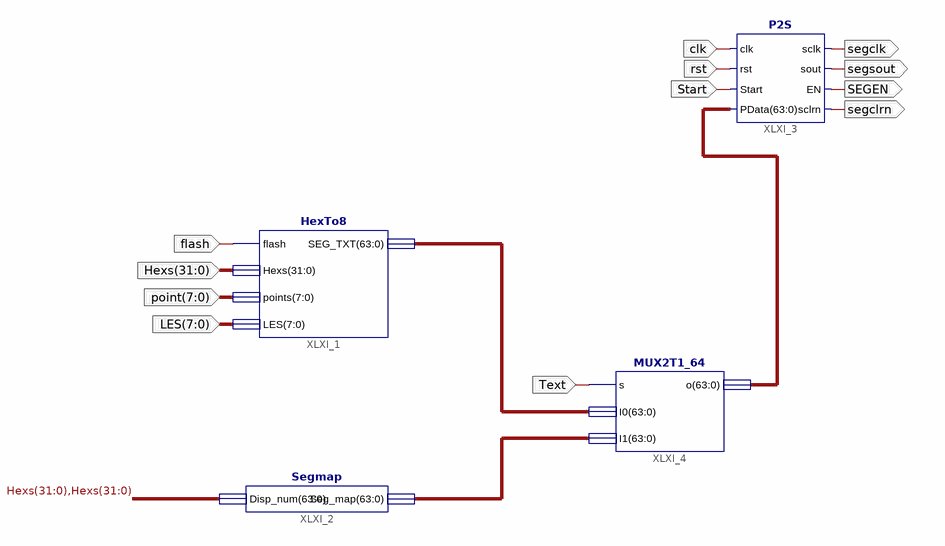
[diagram p0: schematic sheet 1]
// Xilinx ISE schematic Display.sch (kintex7) as structural Verilog: 4 symbols, 12 ports
module Display (
  input  flash,
  input  [31:0] Hexs,
  input  [7:0] point,
  input  [7:0] LES,
  input  rst,
  input  Start,
  input  clk,
  input  Text,
  output segclrn,
  output segsout,
  output SEGEN,
  output segclk
);

  wire [63:0] XLXN_13, XLXN_14, XLXN_15;

  HexTo8 XLXI_1 (.flash(flash), .Hexs(Hexs), .points(point), .LES(LES), .SEG_TXT(XLXN_13));
  Segmap XLXI_2 (.Disp_num({Hexs, Hexs}), .Seg_map(XLXN_14));
  P2S XLXI_3 (
    .sclrn(segclrn), .sout(segsout), .rst(rst), .EN(SEGEN), .Start(Start), .clk(clk), .sclk(segclk),
    .PData(XLXN_15));
  MUX2T1_64 XLXI_4 (.s(Text), .I0(XLXN_13), .I1(XLXN_14), .o(XLXN_15));
endmodule
